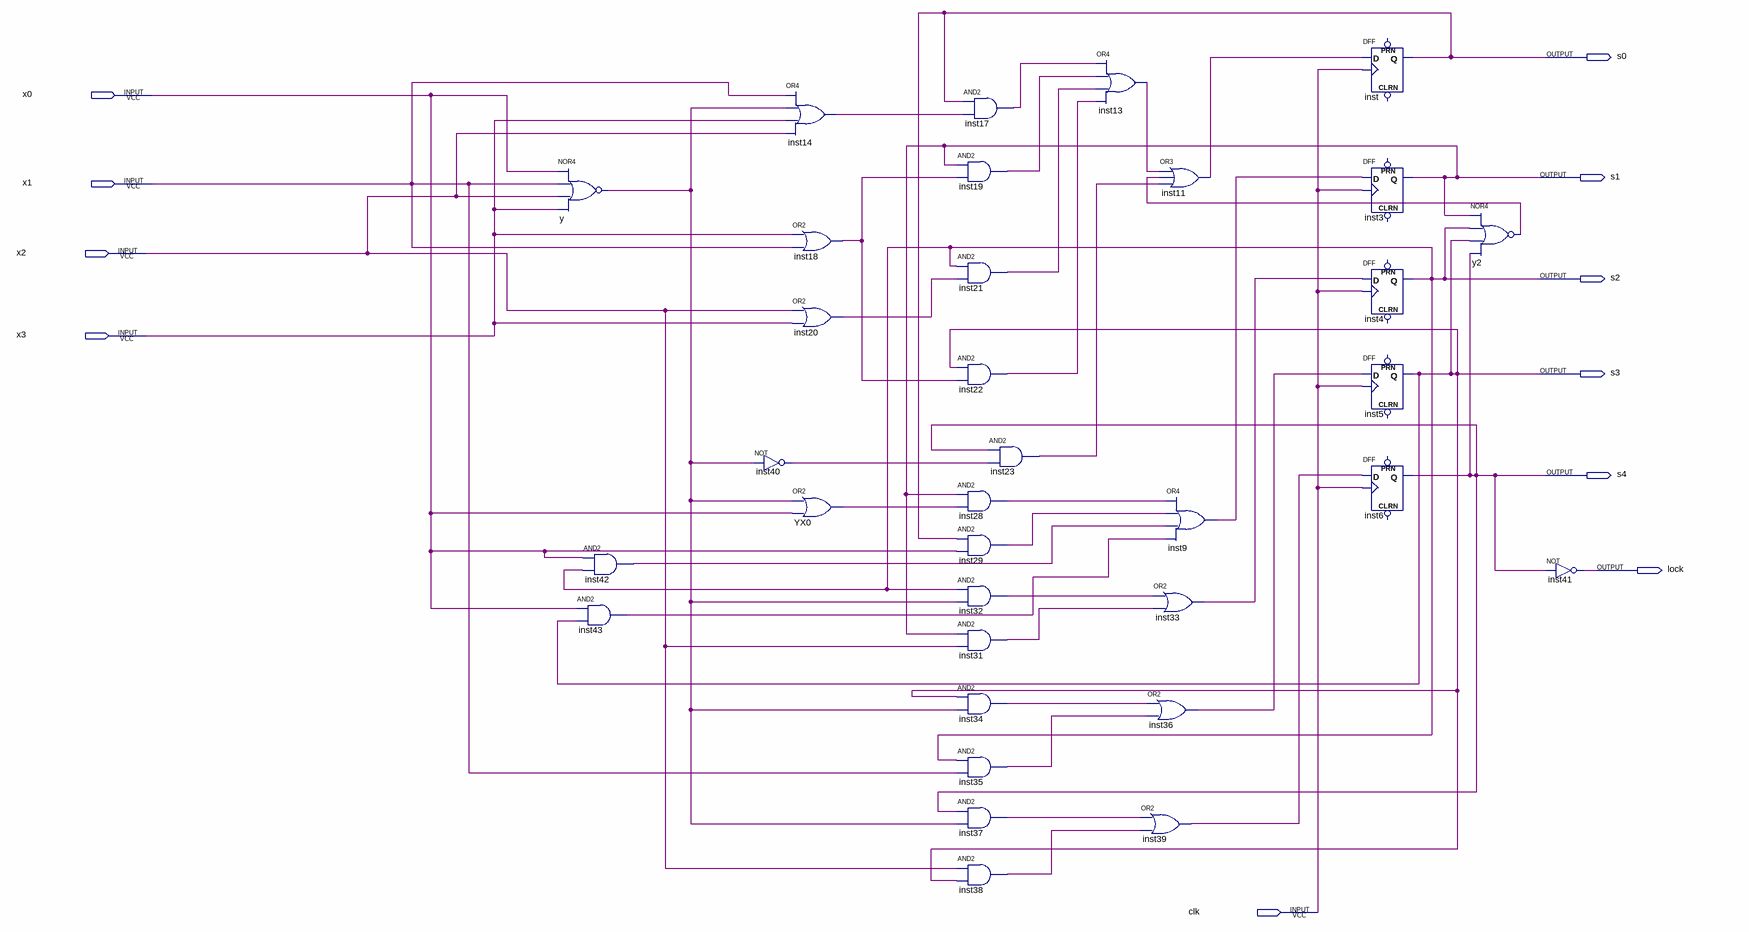
[diagram p0: schematic sheet]
// Quartus schematic clock.bdf as structural Verilog: 34 symbols, 11 pins
module clock (
  input  x0,
  input  x1,
  input  x2,
  input  x3,
  input  clk,
  output s0,
  output s1,
  output s2,
  output s3,
  output s4,
  output lock
);

  wire inst9_out, inst11_out, inst13_out, inst14_out, inst17_out, inst18_out, inst19_out, inst20_out,
       inst21_out, inst22_out, inst23_out, inst28_out, inst29_out, inst31_out, inst32_out, inst33_out,
       inst34_out, inst35_out, inst36_out, inst37_out, inst38_out, inst39_out, inst40_out, inst42_out,
       inst43_out, y2_out, y_out, YX0_out;

  nor y (y_out, x0, x1, x2, x3);
  and inst42 (inst42_out, x0, s2);
  and inst43 (inst43_out, x0, s3);
  or inst14 (inst14_out, x1, y_out, x3, x2);
  or inst18 (inst18_out, x3, x1);
  or inst20 (inst20_out, x2, x3);
  not inst40 (inst40_out, y_out);
  or YX0 (YX0_out, y_out, x0);
  and inst17 (inst17_out, s0, inst14_out);
  and inst19 (inst19_out, s1, inst18_out);
  and inst21 (inst21_out, s2, inst20_out);
  and inst22 (inst22_out, s3, inst18_out);
  and inst23 (inst23_out, s4, inst40_out);
  and inst28 (inst28_out, s1, YX0_out);
  and inst29 (inst29_out, s0, x0);
  and inst32 (inst32_out, s2, y_out);
  and inst31 (inst31_out, s1, x2);
  and inst34 (inst34_out, s3, y_out);
  and inst35 (inst35_out, s2, x1);
  and inst37 (inst37_out, s4, y_out);
  and inst38 (inst38_out, x2, s3);
  or inst13 (inst13_out, inst17_out, inst19_out, inst21_out, inst22_out);
  or inst33 (inst33_out, inst32_out, inst31_out);
  or inst36 (inst36_out, inst34_out, inst35_out);
  or inst39 (inst39_out, inst37_out, inst38_out);
  or inst11 (inst11_out, inst13_out, y2_out, inst23_out);
  or inst9 (inst9_out, inst28_out, inst29_out, inst42_out, inst43_out);
  DFF inst (.CLK(clk), .D(inst11_out), .Q(s0));  // open: CLRN, PRN
  DFF inst3 (.CLK(clk), .D(inst9_out), .Q(s1));  // open: CLRN, PRN
  DFF inst4 (.CLK(clk), .D(inst33_out), .Q(s2));  // open: CLRN, PRN
  DFF inst5 (.CLK(clk), .D(inst36_out), .Q(s3));  // open: CLRN, PRN
  DFF inst6 (.CLK(clk), .D(inst39_out), .Q(s4));  // open: CLRN, PRN
  nor y2 (y2_out, s1, s2, s3, s4);
  not inst41 (lock, s4);
endmodule
